# EAGLE design SECSENSE (EAGLE 6.3)
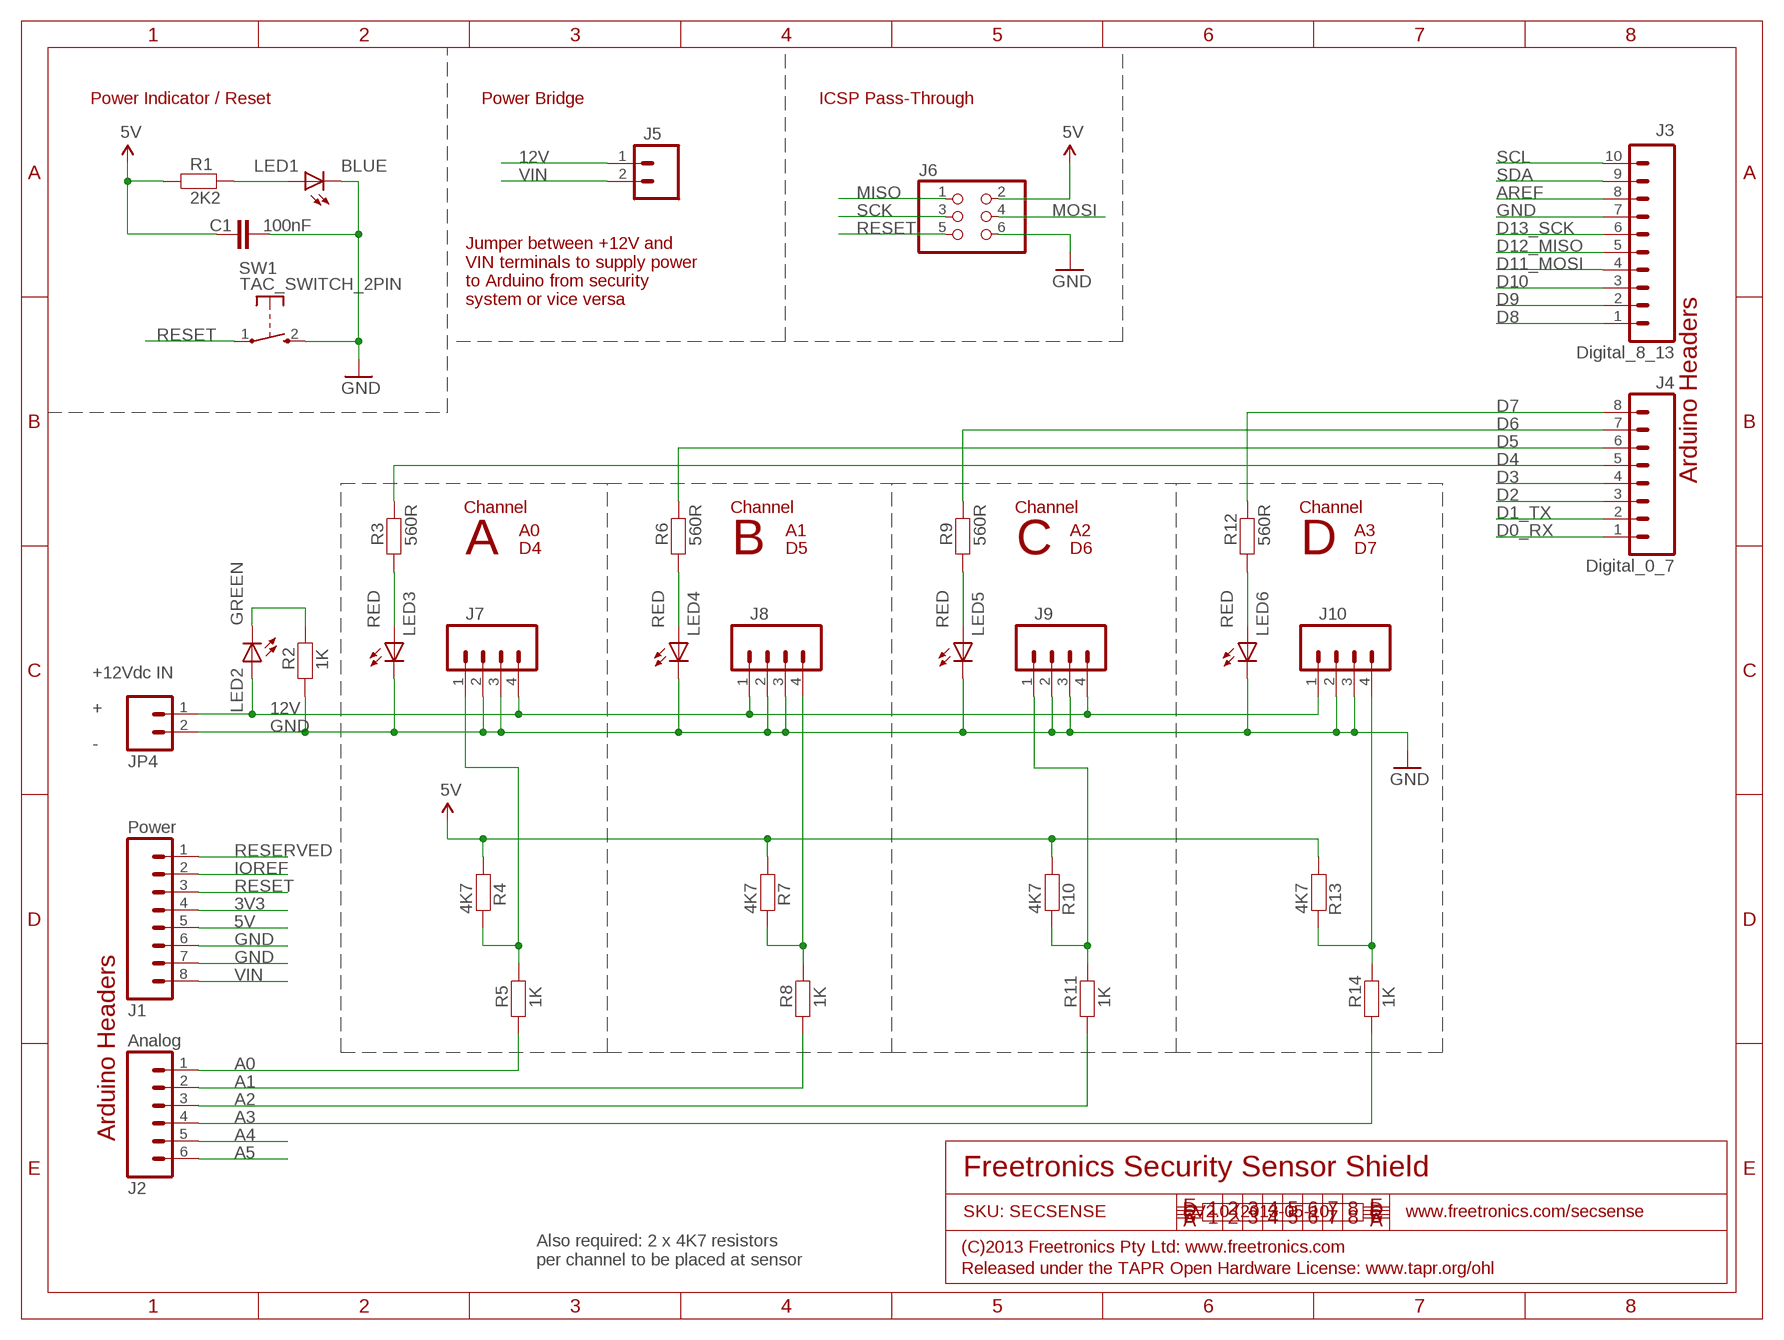
[diagram p0: schematic, sheet 1]

## Parts
C1  100nF  CAP0603  [0603]
J1  Power  M08  [1X08]
J2  Analog  M06SIP  [1X06]
J3  Digital_8_13  M100.1  [1X10]
J4  Digital_0_7  M08  [1X08]
J5  M02PTH  [1X02]
J6  PINHD-2X3  [2X03]
J7  M04SCREW  [SCREWTERMINAL-3.5MM-4]
J8  M04SCREW  [SCREWTERMINAL-3.5MM-4]
J9  M04SCREW  [SCREWTERMINAL-3.5MM-4]
J10  M04SCREW  [SCREWTERMINAL-3.5MM-4]
JP4  M023.5MM  [SCREWTERMINAL-3.5MM-2]
LED1  BLUE  LED0603  [LED-0603]
LED2  GREEN  LED0603  [LED-0603]
LED3  RED  LED0603  [LED-0603]
LED4  RED  LED0603  [LED-0603]
LED5  RED  LED0603  [LED-0603]
LED6  RED  LED0603  [LED-0603]
R1  2K2  RESISTOR0603  [0603]
R2  1K  RESISTOR0603  [0603]
R3  560R  RESISTOR0603  [0603]
R4  4K7  RESISTOR0603  [0603]
R5  1K  RESISTOR0603  [0603]
R6  560R  RESISTOR0603  [0603]
R7  4K7  RESISTOR0603  [0603]
R8  1K  RESISTOR0603  [0603]
R9  560R  RESISTOR0603  [0603]
R10  4K7  RESISTOR0603  [0603]
R11  1K  RESISTOR0603  [0603]
R12  560R  RESISTOR0603  [0603]
R13  4K7  RESISTOR0603  [0603]
R14  1K  RESISTOR0603  [0603]
SW1  TAC_SWITCH_2PIN  [TACTILE_SWITCH_SMD_2PIN_TINY]

## Nets
3V3: J1.4
5V: C1.1 J1.5 J6.2 R1.1 R4.1 R7.1 R10.1 R13.1
12V: J5.1 J7.4 J8.1 J9.4 J10.1 JP4.1 LED2.A
A0: J2.1 R5.1
A1: J2.2 R8.1
A2: J2.3 R11.1
A3: J2.4 R14.1
A4: J2.5
A5: J2.6
AREF: J3.8
D0_RX: J4.1
D1_TX: J4.2
D2: J4.3
D3: J4.4
D4: J4.5 R3.2
D5: J4.6 R6.2
D6: J4.7 R9.2
D7: J4.8 R12.2
D8: J3.1
D9: J3.2
D10: J3.3
D11_MOSI: J3.4
D12_MISO: J3.5
D13_SCK: J3.6
GND: C1.2 J1.6 J1.7 J3.7 J6.6 J7.2 J7.3 J8.2 J8.3 J9.2 J9.3 J10.2 J10.3 JP4.2 LED1.C LED3.C LED4.C LED5.C LED6.C R2.1 SW1.2(S)
IOREF: J1.2
MISO: J6.1
MOSI: J6.4
N$1: LED2.C R2.2
N$2: LED1.A R1.2
N$3: J8.4 R7.2 R8.2
N$249: J9.1 R10.2 R11.2
N$251: LED6.A R12.1
N$252: LED5.A R9.1
N$253: LED4.A R6.1
N$254: LED3.A R3.1
N$256: J10.4 R13.2 R14.2
N$262: J7.1 R4.2 R5.2
RESERVED: J1.1
RESET: J1.3 J6.5 SW1.1(P)
SCK: J6.3
SCL: J3.10
SDA: J3.9
VIN: J1.8 J5.2

## Notes on the sheet
- Power Indicator / Reset | Power Bridge | ICSP Pass-Through
- Jumper between +12V and
  VIN terminals to supply power
  to Arduino from security
  system or vice versa
- Arduino Headers
- Channel | Channel | Channel | Channel
- A0 | A1 | A2 | A3
- A | D4 | B | D5 | C | D6 | D | D7
- +12Vdc IN
- +
- -
- Arduino Headers
- Freetronics Security Sensor Shield
- SKU: SECSENSE | V2.0 (2013-05-10) | www.freetronics.com/secsense
- (C)2013 Freetronics Pty Ltd: www.freetronics.com
- Also required: 2 x 4K7 resistors
  per channel to be placed at sensor
- Released under the TAPR Open Hardware License: www.tapr.org/ohl

## Library data of the parts
C1 = freetronics-master-v1:CAP: Capacitor Standard 0603 ceramic capacitor, and 0.1" leaded capacitor.
J1 J4 = freetronics:M08: Header 8 Standard 8-pin 0.1" header. Use with straight break away headers (SKU : PRT-00116), right angle break away headers (PRT-00553), swiss pins (PRT-00743), machine pins (PRT-00117), and female headers (PRT-00115).
J2 = freetronics:M06: Header 6 Standard 6-pin 0.1" header. Use with straight break away headers (SKU : PRT-00116), right angle break away headers (PRT-00553), swiss pins (PRT-00743), machine pins (PRT-00117), and female headers (PRT-00115). Molex polarized connector foot print use with SKU : PRT-08094 with associated crimp pins and housings. NOTES ON THE VARIANTS LOCK and LOCK_LONGPADS... This footprint was designed to help hold the alignment of a through-hole component (i.e. 6-pin header) while soldering it into place. You may notice that each hole has been shifted either up or down by 0.005 of an inch from it's more standard position (which is a perfectly straight line). This slight alteration caused the pins (the squares in the middle) to touch the edges of the holes. Because they are alternating, it causes a "brace" to hold the component in place. 0.005 has proven to be the perfect amount of "off-center" position when using our standard breakaway headers. Although looks a little odd when you look at the bare footprint, once you have a header in there, the alteration is very hard to notice. Also, if you push a header all the way into place, it is covered up entirely on the bottom side. This idea of altering the position of holes to aid alignment will be further integrated into the Sparkfun Library for other footprints. It can help hold any component with 3 or more connection pins.
J3 = freetronics-original:M10: Header 10 Standard 10-pin 0.1" header. Use with straight break away headers (SKU : PRT-00116), right angle break away headers (PRT-00553), swiss pins (PRT-00743), machine pins (PRT-00117), and female headers (PRT-00115).
J5 = freetronics-original:M02: Header 2 Standard 2-pin 0.1" header. Use with straight break away headers (SKU : PRT-00116), right angle break away headers (PRT-00553), swiss pins (PRT-00743), machine pins (PRT-00117), and female headers (PRT-00115). Molex polarized connector foot print use with SKU : PRT-08233 with associated crimp pins and housings.
J6 = freetronics-master-v1.1:PINHD-2X3: PIN HEADER
J7-J10 = freetronics-master-v1.1:M04: Header 4 Standard 4-pin 0.1" header. Use with straight break away headers (SKU : PRT-00116), right angle break away headers (PRT-00553), swiss pins (PRT-00743), machine pins (PRT-00117), and female headers (PRT-00115). Molex polarized connector foot print use with SKU : PRT-08231 with associated crimp pins and housings.
JP4 = freetronics-master-v1.1:M02: Header 2 Standard 2-pin 0.1" header. Use with straight break away headers (SKU : PRT-00116), right angle break away headers (PRT-00553), swiss pins (PRT-00743), machine pins (PRT-00117), and female headers (PRT-00115). Molex polarized connector foot print use with SKU : PRT-08233 with associated crimp pins and housings.
LED1-LED6 = freetronics-jon:LED: LEDs Standard schematic elements and footprints for 5mm, 3mm, 1206, and 0603 sized LEDs. 5mm - Spark Fun Electronics SKU : COM-00529 (and others)
R1-R14 = freetronics-jon:RESISTOR: Resistor Basic schematic elements and footprints for 0603, 1206, and PTH 1/10th watt (small) resistors.
SW1 = freetronics-master-v1.1:TAC_SWITCH_2PIN: Momentary Tactile Switch - 2 pin

## Board
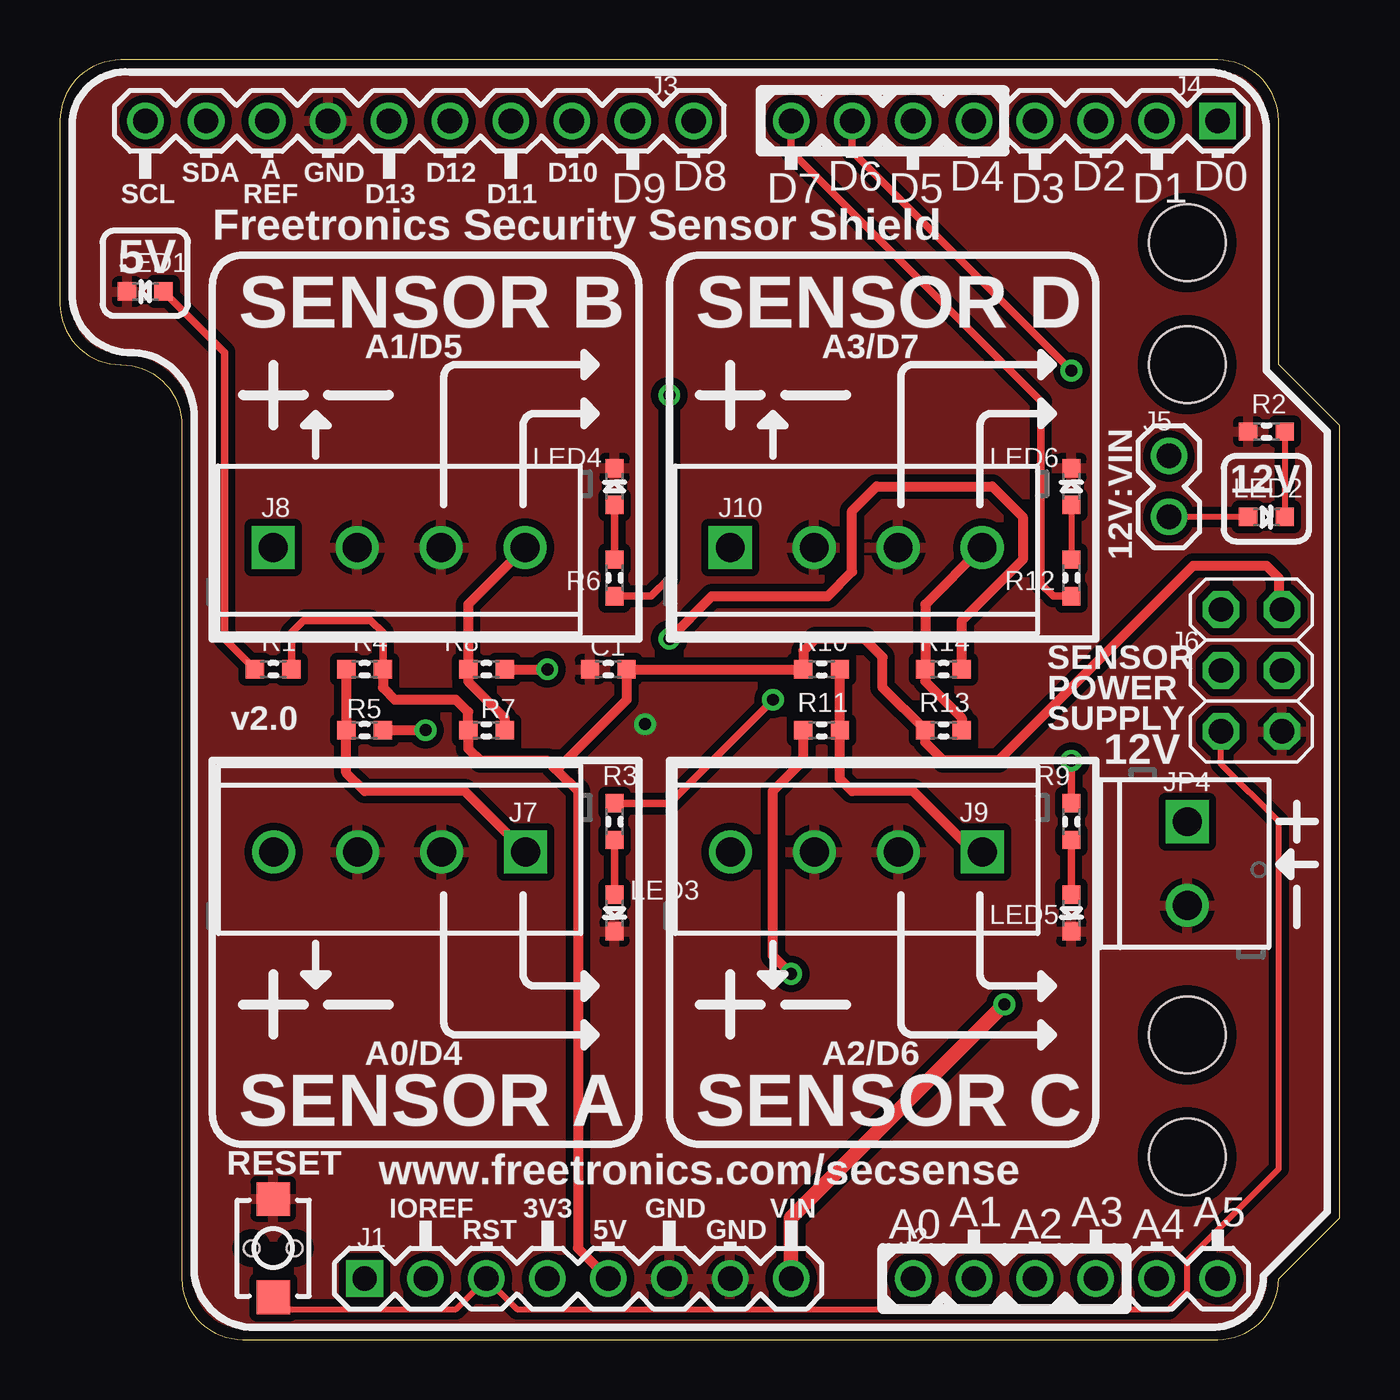
[diagram p1: board, top side]
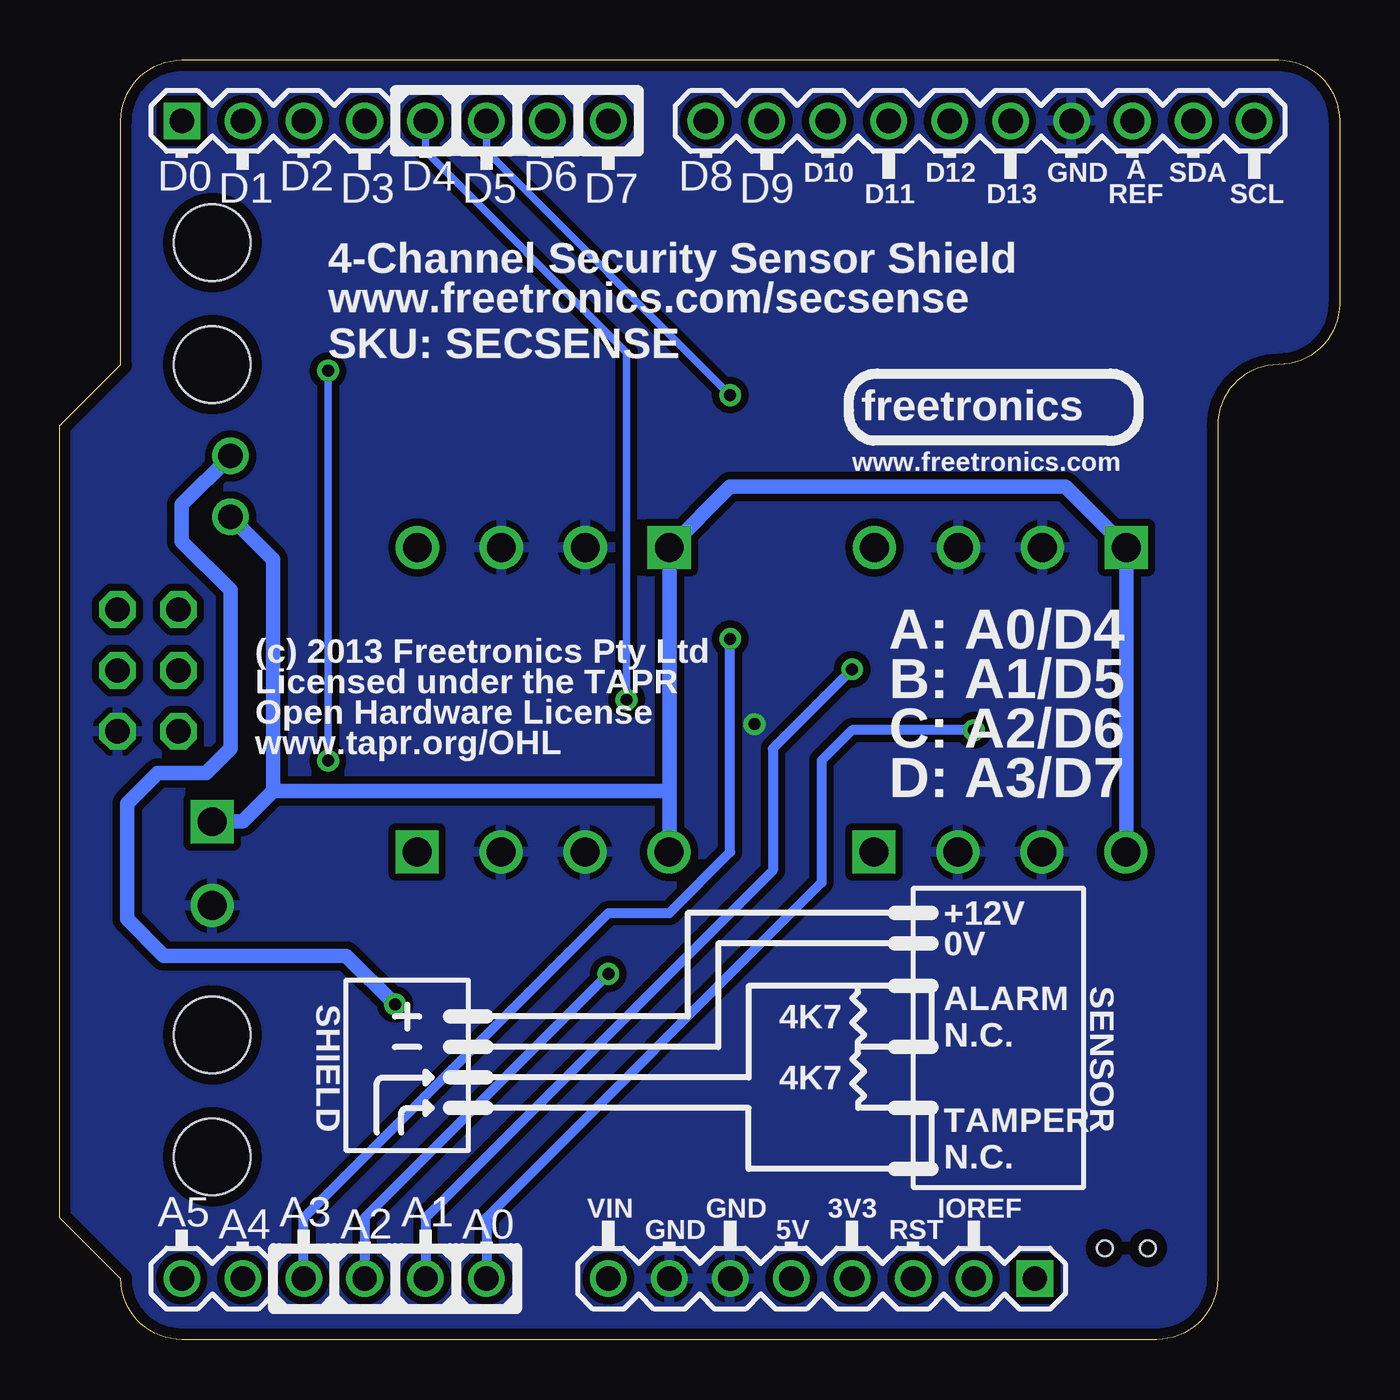
[diagram p2: board, bottom side, seen from below]

Size 53.34 x 53.34 mm. Coordinates in mm from the lower left corner, seen from the top.
Outline: 5.08,2.54 arc90 7.62,0 48.26,0 arc90 50.8,2.54 53.34,5.08 53.34,38.1 50.8,40.64 50.8,50.8 arc90 48.26,53.34 2.54,53.34 arc90 0,50.8 0,43.18 arc90 2.54,40.64 arc-90 5.08,38.1 5.08,2.54
Copper layers (1*16): Top 0.035mm / dielectric 1.5mm / Bottom 0.035mm
Design rules "default *": minimum track width 10mil, minimum drill 24mil, track to track 12mil, track to pad 12mil, pad to pad 12mil, via to via 12mil, smd to smd 8mil, copper to edge 18mil, drill to drill 8mil, minimum pad ring 10mil, minimum via ring 8mil, stop-mask expansion 4mil, vias tented up to drill 25mil, thermal gap 10mil
Holes 3.2 mm at 46.99,40.64 46.99,45.72 46.99,12.7 46.99,7.62

### Footprints (pad centres in the part's own frame; a part is rotated, then mirrored left to right if it is on the bottom)
0603 = smd 0.762 x 0.762: 1 -0.762,0; 2 0.762,0
1X08 = drill 1.016 square: 1 0,0 | drill 1.016: 2 2.54,0; 3 5.08,0; 4 7.62,0; 5 10.16,0; 6 12.7,0; 7 15.24,0; 8 17.78,0
1X06 = drill 1.016: 1 0,0; 2 2.54,0; 3 5.08,0; 4 7.62,0; 5 10.16,0; 6 12.7,0
1X10 = drill 1.016: 1 0,0; 2 2.54,0; 3 5.08,0; 4 7.62,0; 5 10.16,0; 6 12.7,0; 7 15.24,0; 8 17.78,0; 9 20.32,0; 10 22.86,0
1X02 = drill 1.016: 1 0,0; 2 2.54,0
2X03 = drill 1.016 octagon: 1 -2.54,-1.27; 2 -2.54,1.27; 3 0,-1.27; 4 0,1.27; 5 2.54,-1.27; 6 2.54,1.27
SCREWTERMINAL-3.5MM-4 = drill 1.2 square: 1 0,0 | drill 1.2: 2 3.5,0; 3 7,0; 4 10.5,0
SCREWTERMINAL-3.5MM-2 = drill 1.2 square: 1 0,0 | drill 1.2: 2 3.5,0
LED-0603 = smd 0.762 x 0.762: A -0.762,0; C 0.762,0
TACTILE_SWITCH_SMD_2PIN_TINY = smd 1.4 x 1.4: 1 -2.05,0; 2 2.05,0 | hole 0.65: 0,0.9; 0,-0.9

### Placement (x,y rotation side)
C1  22.86,27.94 180 top
J1  12.7,2.54 0 top
J2  35.56,2.54 0 top
J3  26.42,50.8 180 top
J4  48.26,50.8 180 top
J5  46.23,34.29 90 top
J6  49.67,27.89 270 top
J7  19.41,20.32 180 top
J8  8.89,33.02 0 top
J9  38.46,20.32 180 top
J10  27.94,33.02 0 top
JP4  46.99,21.59 270 top
LED1  3.56,43.69 180 top
LED2  50.29,34.29 0 top
LED3  23.11,17.78 270 top
LED4  23.11,35.56 90 top
LED5  42.16,17.78 270 top
LED6  42.16,35.56 90 top
R1  8.89,27.94 180 top
R2  50.29,37.85 0 top
R3  23.11,21.59 90 top
R4  12.7,27.94 180 top
R5  12.7,25.4 180 top
R6  23.11,31.75 270 top
R7  17.78,25.4 0 top
R8  17.78,27.94 180 top
R9  42.16,21.59 90 top
R10  31.75,27.94 0 top
R11  31.75,25.4 0 top
R12  42.16,31.75 270 top
R13  36.83,25.4 0 top
R14  36.83,27.94 180 top
SW1  8.89,3.81 90 top

### Tracks (layer width: path | path; a pad name or v marks a point on that pad's centre or on a via)
5V
  Top 0.305: R4.1 13.46,29.46 12.95,29.97 10.16,29.97 9.65,29.46 R1.1
  Top 0.406: 20.7,23.75 20.32,24.13 17.53,24.13 17.02,24.64 R7.1 17.02,26.16 16.51,26.67 13.97,26.67 13.46,27.18 R4.1 | 20.7,23.75 21.59,22.86 21.59,3.81 J1.5 | 20.7,23.75 23.62,26.67 C1.1 R10.1 30.99,28.7 31.5,29.21 33.53,29.21 34.29,28.45 34.29,27.18 R13.1 36.07,24.89 36.83,24.13 39.12,24.13 47.24,32.26 50.29,32.26 50.8,31.75 50.8,30.57 J6.2
12V
  Top 0.254: LED2.A J5.1
  Bottom 0.61: 27.94,22.86 27.94,20.32 J9.4 | 27.94,22.86 J10.1 25.4,35.56 11.43,35.56 J8.1 8.89,20.34 J7.4 | J5.1 44.45,32.51 44.45,22.86 | 27.94,22.86 44.45,22.86 | 44.45,22.86 45.72,21.59 JP4.1
A0  (via drill 0.5)
  Top 0.406: R5.1 v15.24,25.4
  Bottom 0.406: v15.24,25.4 20.32,25.4 21.59,24.13 21.59,19.05 35.56,5.08 J2.1
A1  (via drill 0.5)
  Top 0.406: R8.1 v20.32,27.94
  Bottom 0.406: v20.32,27.94 23.62,24.64 23.62,19.56 38.1,5.08 J2.2
A2  (via drill 0.5)
  Top 0.406: v30.48,15.24 29.72,16 29.72,22.86 30.99,24.13 R11.1
  Bottom 0.406: v30.48,15.24 40.64,5.08 J2.3
A3  (via drill 0.5)
  Top 0.406: v25.4,29.21 27.18,30.99 32,30.99 33.02,32 33.02,34.54 34.04,35.56 38.86,35.56 40.13,34.29 40.13,32.51 37.59,29.97 R14.1
  Bottom 0.406: J2.4 43.18,5.08 30.48,17.78 27.94,17.78 25.4,20.32 v25.4,29.21
D4  (via drill 0.5)
  Top 0.305: R3.2 25.4,22.35 v29.72,26.67
  Bottom 0.305: v29.72,26.67 29.72,41.15 38.1,49.53 J4.5
D5  (via drill 0.5)
  Top 0.305: R6.2 24.64,30.99 25.4,31.75 v25.4,39.37
  Bottom 0.305: v25.4,39.37 35.56,49.53 J4.6
D6  (via drill 0.5)
  Top 0.305: v42.16,24.13 R9.2 | v42.16,40.39 33.02,49.53 J4.7
  Bottom 0.305: v42.16,40.39 v42.16,24.13
D7
  Top 0.305: R12.2 41.4,30.99 40.89,31.5 40.89,39.12 30.48,49.53 J4.8
GND  (via drill 0.5)
  other vias: 24.38,25.65
  pour Bottom: 0,50.8 arc-74 2.54,53.34 48.26,53.34 arc-74 50.8,50.8 50.8,40.64 53.34,38.1 53.34,5.08 50.8,2.54 arc-74 48.26,0 7.62,0 arc-74 5.08,2.54 5.08,38.1 arc90 2.54,40.64 arc-90 0,43.18
  pour Top: 0,50.8 arc-74 2.54,53.34 48.26,53.34 arc-74 50.8,50.8 50.8,40.64 53.34,38.1 53.34,5.08 50.8,2.54 arc-74 48.26,0 7.62,0 arc-74 5.08,2.54 5.08,38.1 arc90 2.54,40.64 arc-90 0,43.18
N$1
  Top 0.254: R2.2 LED2.C
N$2
  Top 0.305: R1.2 6.86,29.21 6.86,41.15 LED1.A
N$3
  Top 0.406: J8.4 17.02,30.65 R8.2 17.02,27.43 18.54,25.91 R7.2
N$249
  Top 0.406: J9.1 38.1,20.32 35.56,22.86 33.02,22.86 32.51,23.37 R11.2 R10.2
N$251
  Top 0.254: LED6.A R12.1
N$252
  Top 0.305: LED5.A R9.1
N$253
  Top 0.305: LED4.A R6.1
N$254
  Top 0.305: R3.1 LED3.A
N$256
  Top 0.406: J10.4 36.07,30.65 R14.2 36.07,27.43 37.59,25.91 R13.2
N$262
  Top 0.406: J7.1 16.87,22.86 12.7,22.86 11.94,23.62 R5.2 R4.2
RESET
  Top 0.254: SW1.1 9.38,1.27 16.51,1.27 J1.3 19.05,1.27 46.23,1.27 46.99,2.03 46.99,3.3 50.8,7.11 50.8,21.59 48.4,23.99 J6.5
VIN  (via drill 0.5)
  Top 0.61: J1.8 30.48,5.08 v39.37,13.97
  Bottom 0.61: J5.2 48.26,34.8 48.26,33.27 46.23,31.24 46.23,24.64 47.24,23.62 49.28,23.62 50.55,22.35 50.55,17.53 49.02,16 41.4,16 v39.37,13.97

### Text on the board
tPlace: SDA | A | GND | D12 | D10 | D8 | D6 | D4 | D2 | D0 | SCL | REF | D13 | D11 | D9 | D7 | D5 | D3 | D1 | Freetronics Security Sensor Shield | 5V | SENSOR B | SENSOR D | A1/D5 | A3/D7 | 12V | 12V:VIN | SENSOR | POWER | v2.0 | SUPPLY | 12V | A0/D4 | A2/D6 | SENSOR A | SENSOR C | RESET | www.freetronics.com/secsense | IOREF | 3V3 | GND | VIN | A1 | A3 | A5 | RST | 5V | GND | A0 | A2 | A4
bPlace: SDA | A | GND | D12 | D10 | D8 | D6 | D4 | D2 | D0 | SCL | REF | D13 | D11 | D9 | D7 | D5 | D3 | D1 | 4-Channel Security Sensor Shield | www.freetronics.com/secsense | SKU: SECSENSE | freetronics | www.freetronics.com | (c) 2013 Freetronics Pty Ltd | Licensed under the TAPR | Open Hardware License | www.tapr.org/OHL | A: A0/D4 / B: A1/D5 / C: A2/D6 / D: A3/D7 | +12V | 0V | SENSOR | SHIELD | 4K7 | ALARM / N.C. | 4K7 | TAMPER / N.C. | IOREF | 3V3 | GND | VIN | A1 | A3 | A5 | RST | 5V | GND | A0 | A2 | A4
tDocu: K | A | K | K | A | A | A | K | A | A | K | K